# Altium project PCB_Electronic_Lab_v0.PrjPcb
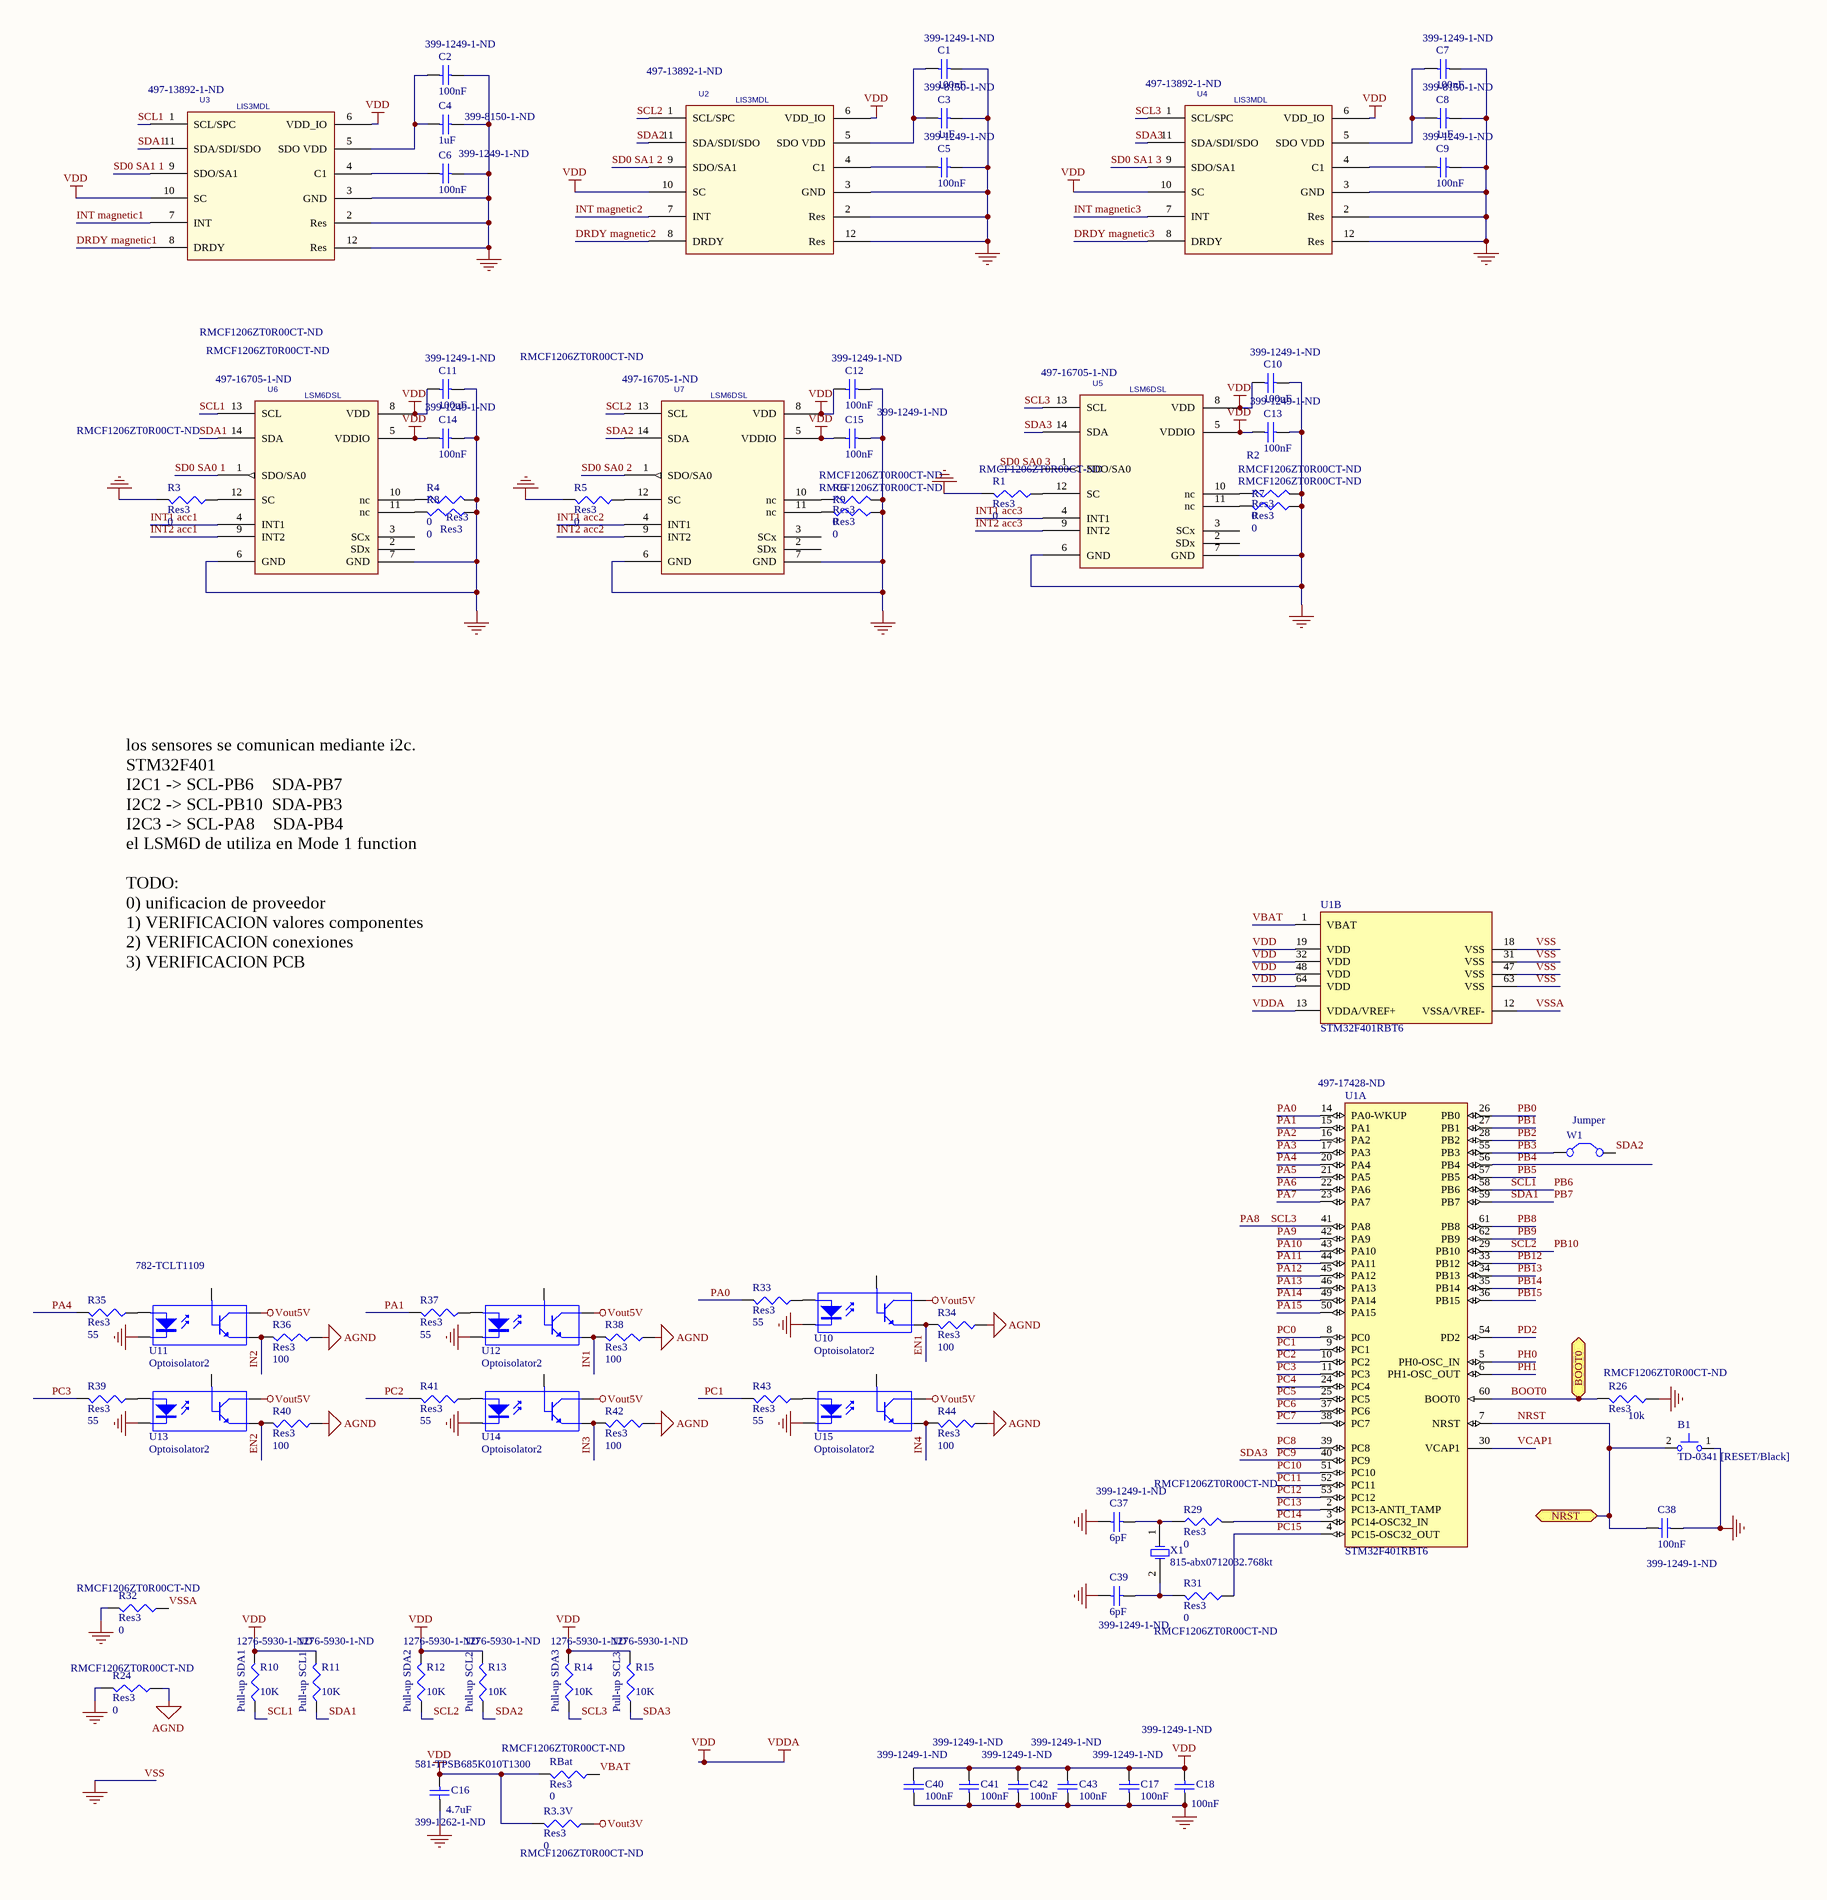
[diagram p0: PCB1.SchDoc, left]
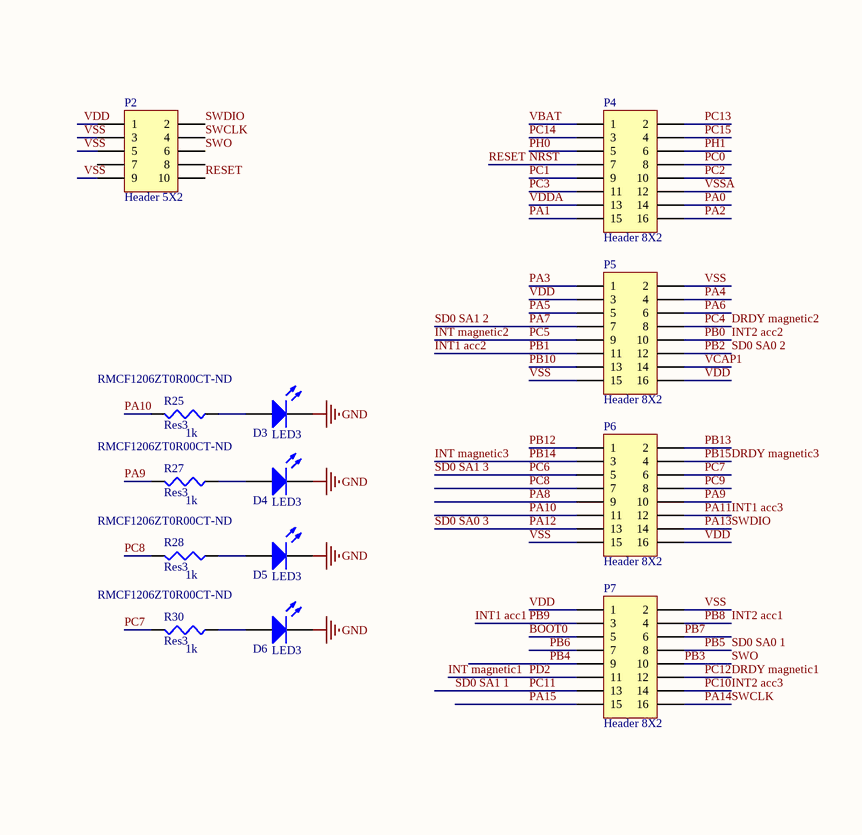
[diagram p1: PCB1.SchDoc, right]
2 sheets, 123 parts. Net scope: global (net labels, ports and power ports of the same name join across sheets).
Board file: PCB2.PcbDoc
Sheets:
  PCB1.SchDoc
  Driver&Converter.SchDoc

## Sheet PCB1.SchDoc
size A2

### Parts
B1  TD-0341 [RESET/Black]  [KSS-2G]
C1  value 100nF  Supplier Part Number 1: 399-1249-1-ND  [C1206]  (hidden comment: Cap Semi)
C2  value 100nF  Supplier Part Number 1: 399-1249-1-ND  [C1206]  (hidden comment: Cap Semi)
C3  value 1uF  Supplier Part Number 1: 399-8150-1-ND  [C1206]  (hidden comment: Cap Semi)
C4  value 1uF  Supplier Part Number 1: 399-8150-1-ND  [C1206]  (hidden comment: Cap Semi)
C5  value 100nF  Supplier Part Number 1: 399-1249-1-ND  [C1206]  (hidden comment: Cap Semi)
C6  value 100nF  Supplier Part Number 1: 399-1249-1-ND  [C1206]  (hidden comment: Cap Semi)
C7  value 100nF  Supplier Part Number 1: 399-1249-1-ND  [C1206]  (hidden comment: Cap Semi)
C8  value 1uF  Supplier Part Number 1: 399-8150-1-ND  [C1206]  (hidden comment: Cap Semi)
C9  value 100nF  Supplier Part Number 1: 399-1249-1-ND  [C1206]  (hidden comment: Cap Semi)
C10  value 100nF  Supplier Part Number 1: 399-1249-1-ND  [C1206]  (hidden comment: Cap Semi)
C11  value 100nF  Supplier Part Number 1: 399-1249-1-ND  [C1206]  (hidden comment: Cap Semi)
C12  value 100nF  Supplier Part Number 1: 399-1249-1-ND  [C1206]  (hidden comment: Cap Semi)
C13  value 100nF  Supplier Part Number 1: 399-1249-1-ND  [C1206]  (hidden comment: Cap Semi)
C14  value 100nF  Supplier Part Number 1: 399-1249-1-ND  [C1206]  (hidden comment: Cap Semi)
C15  value 100nF  Supplier Part Number 1: 399-1249-1-ND  [C1206]  (hidden comment: Cap Semi)
C16  value 4.7uF  Supplier Part Number 1: 399-1262-1-ND  Supplier Part Number 2: 581-TPSB685K010T1300  [C1206]  (hidden comment: Cap Semi)
C17  value 100nF  Supplier Part Number 1: 399-1249-1-ND  [C1206]  (hidden comment: Cap Semi)
C18  value 100nF  Supplier Part Number 1: 399-1249-1-ND  [C1206]  (hidden comment: Cap Semi)
C37  value 6pF  Supplier Part Number 1: 399-1249-1-ND  [C1206]  (hidden comment: Cap Semi)
C38  value 100nF  Supplier Part Number 1: 399-1249-1-ND  [C1206]  (hidden comment: Cap Semi)
C39  value 6pF  Supplier Part Number 1: 399-1249-1-ND  [C1206]  (hidden comment: Cap Semi)
C40  value 100nF  Supplier Part Number 1: 399-1249-1-ND  [C1206]  (hidden comment: Cap Semi)
C41  value 100nF  Supplier Part Number 1: 399-1249-1-ND  [C1206]  (hidden comment: Cap Semi)
C42  value 100nF  Supplier Part Number 1: 399-1249-1-ND  [C1206]  (hidden comment: Cap Semi)
C43  value 100nF  Supplier Part Number 1: 399-1249-1-ND  [C1206]  (hidden comment: Cap Semi)
D3  LED3  [3.5X2.8X1.9]
D4  LED3  [3.5X2.8X1.9]
D5  LED3  [3.5X2.8X1.9]
D6  LED3  [3.5X2.8X1.9]
P2  Header 5X2  [HDR2X5]
P4  Header 8X2  [HDR2X8]
P5  Header 8X2  [HDR2X8]
P6  Header 8X2  [HDR2X8]
P7  Header 8X2  [HDR2X8]
R1  Res3  value 0  Supplier Part Number 1: RMCF1206ZT0R00CT-ND  [J1-0603]
R2  Res3  value 0  Supplier Part Number 1: RMCF1206ZT0R00CT-ND  [J1-0603]
R3  Res3  value 0  Supplier Part Number 1: RMCF1206ZT0R00CT-ND  [J1-0603]
R3.3V  Res3  value 0  Supplier Part Number 1: RMCF1206ZT0R00CT-ND  [J1-0603]
R4  Res3  value 0  Supplier Part Number 1: RMCF1206ZT0R00CT-ND  [J1-0603]
R5  Res3  value 0  Supplier Part Number 1: RMCF1206ZT0R00CT-ND  [J1-0603]
R6  Res3  value 0  Supplier Part Number 1: RMCF1206ZT0R00CT-ND  [J1-0603]
R7  Res3  value 0  Supplier Part Number 1: RMCF1206ZT0R00CT-ND  [J1-0603]
R8  Res3  value 0  Supplier Part Number 1: RMCF1206ZT0R00CT-ND  [J1-0603]
R9  Res3  value 0  Supplier Part Number 1: RMCF1206ZT0R00CT-ND  [J1-0603]
R10  Pull-up SDA1  value 10K  Supplier Part Number 1: 1276-5930-1-ND  [J1-0603]
R11  Pull-up SCL1  value 10K  Supplier Part Number 1: 1276-5930-1-ND  [J1-0603]
R12  Pull-up SDA2  value 10K  Supplier Part Number 1: 1276-5930-1-ND  [J1-0603]
R13  Pull-up SCL2  value 10K  Supplier Part Number 1: 1276-5930-1-ND  [J1-0603]
R14  Pull-up SDA3  value 10K  Supplier Part Number 1: 1276-5930-1-ND  [J1-0603]
R15  Pull-up SCL3  value 10K  Supplier Part Number 1: 1276-5930-1-ND  [J1-0603]
R24  Res3  value 0  Supplier Part Number 1: RMCF1206ZT0R00CT-ND  [J1-0603]
R25  Res3  value 1k  Supplier Part Number 1: RMCF1206ZT0R00CT-ND  [J1-0603]
R26  Res3  value 10k  Supplier Part Number 1: RMCF1206ZT0R00CT-ND  [J1-0603]
R27  Res3  value 1k  Supplier Part Number 1: RMCF1206ZT0R00CT-ND  [J1-0603]
R28  Res3  value 1k  Supplier Part Number 1: RMCF1206ZT0R00CT-ND  [J1-0603]
R29  Res3  value 0  Supplier Part Number 1: RMCF1206ZT0R00CT-ND  [J1-0603]
R30  Res3  value 1k  Supplier Part Number 1: RMCF1206ZT0R00CT-ND  [J1-0603]
R31  Res3  value 0  Supplier Part Number 1: RMCF1206ZT0R00CT-ND  [J1-0603]
R32  Res3  value 0  Supplier Part Number 1: RMCF1206ZT0R00CT-ND  [J1-0603]
R33  Res3  value 55  [J1-0603]
R34  Res3  value 100  [J1-0603]
R35  Res3  value 55  [J1-0603]
R36  Res3  value 100  [J1-0603]
R37  Res3  value 55  [J1-0603]
R38  Res3  value 100  [J1-0603]
R39  Res3  value 55  [J1-0603]
R40  Res3  value 100  [J1-0603]
R41  Res3  value 55  [J1-0603]
R42  Res3  value 100  [J1-0603]
R43  Res3  value 55  [J1-0603]
R44  Res3  value 100  [J1-0603]
RBat  Res3  value 0  Supplier Part Number 1: RMCF1206ZT0R00CT-ND  [J1-0603]
U1  STM32F401RBT6  Supplier Part Number 3: 497-17428-ND  [STM-LQFP64_N]  (parts A,B of 2)
U2  LIS3MDL  Supplier Part Number 1: 497-13892-1-ND  [LGA12 2x2x1mm]
U3  LIS3MDL  Supplier Part Number 1: 497-13892-1-ND  [LGA12 2x2x1mm]
U4  LIS3MDL  Supplier Part Number 1: 497-13892-1-ND  [LGA12 2x2x1mm]
U5  LSM6DSL  Supplier Part Number 1: 497-16705-1-ND  [LGA14L-2.5X3X0.86p0.5]
U6  LSM6DSL  Supplier Part Number 1: 497-16705-1-ND  [LGA14L-2.5X3X0.86p0.5]
U7  LSM6DSL  Supplier Part Number 1: 497-16705-1-ND  [LGA14L-2.5X3X0.86p0.5]
U10  Optoisolator2  [SOP5(6)]
U11  Optoisolator2  Supplier Part Number 1: 782-TCLT1109  [SOP5(6)]
U12  Optoisolator2  [SOP5(6)]
U13  Optoisolator2  [SOP5(6)]
U14  Optoisolator2  [SOP5(6)]
U15  Optoisolator2  [SOP5(6)]
W1  Jumper  [HDR1X2]
X1  815-abx0712032.768kt  [CAPC3216M]

### Ports
BOOT0, NRST

### Nets
AGND: R24.1 R34.1 R36.1 R38.1 R40.1 R42.1 R44.1
VDD: C10.2 C11.2 C12.2 C13.2 C14.2 C15.2 C16.2 C17.2 C18.2 C40.2 C41.2 C42.2 C43.2 P2.1 P4.13 P5.3 P5.16 P6.16 P7.1 R3.3V.2 R10.2 R11.2 R12.2 R13.2 R14.2 R15.2 RBat.2 U1.13(VDDA/VREF+) U1.19(VDD) U1.32(VDD) U1.48(VDD) U1.64(VDD) U2.6(VDD_IO) U2.10(SC) U3.6(VDD_IO) U3.10(SC) U4.6(VDD_IO) U4.10(SC) U5.5(VDDIO) U5.8(VDD) U6.5(VDDIO) U6.8(VDD) U7.5(VDDIO) U7.8(VDD)  [also labelled VDDA]
Vout3V: R3.3V.1
Vout5V: U10.5(C) U11.5(C) U12.5(C) U13.5(C) U14.5(C) U15.5(C)
VSS: B1.1 C1.1 C2.1 C3.1 C4.1 C5.1 C6.1 C7.1 C8.1 C9.1 C10.1 C11.1 C12.1 C13.1 C14.1 C15.1 C16.1 C17.1 C18.1 C37.2 C38.1 C39.2 C40.1 C41.1 C42.1 C43.1 D3.2(K) D4.2(K) D5.2(K) D6.2(K) P2.3 P2.5 P2.9 P5.2 P5.15 P6.15 P7.2 R1.2 R2.2 R3.2 R4.2 R5.2 R6.2 R7.1 R8.1 R9.1 R24.2 R26.1 R32.2 U1.18(VSS) U1.31(VSS) U1.47(VSS) U1.63(VSS) U2.2(Res) U2.3(GND) U2.12(Res) U3.2(Res) U3.3(GND) U3.12(Res) U4.2(Res) U4.3(GND) U4.12(Res) U5.6(GND) U5.7(GND) U6.6(GND) U6.7(GND) U7.6(GND) U7.7(GND) U10.3(K) U11.3(K) U12.3(K) U13.3(K) U14.3(K) U15.3(K)  [also labelled GND]
BOOT0: P7.5 R26.2 U1.60(BOOT0) ; port BOOT0
DRDY magnetic1: P7.12 U1.53(PC12) U3.8(DRDY)  [also labelled PC12]
DRDY magnetic2: P5.8 U1.24(PC4) U2.8(DRDY)  [also labelled PC4]
DRDY magnetic3: P6.4 U1.36(PB15) U4.8(DRDY)  [also labelled PB15]
EN1: R34.2 U10.4(E)
EN2: R40.2 U13.4(E)
IN1: R38.2 U12.4(E)
IN2: R36.2 U11.4(E)
IN3: R42.2 U14.4(E)
IN4: R44.2 U15.4(E)
INT1 acc1: P7.3 U1.62(PB9) U6.4(INT1)  [also labelled PB9]
INT1 acc2: P5.11 U1.27(PB1) U7.4(INT1)  [also labelled PB1]
INT1 acc3: P6.12 U1.44(PA11) U5.4(INT1)  [also labelled PA11]
INT2 acc1: P7.4 U1.61(PB8) U6.9(INT2)  [also labelled PB8]
INT2 acc2: P5.10 U1.26(PB0) U7.9(INT2)  [also labelled PB0]
INT2 acc3: P7.14 U1.51(PC10) U5.9(INT2)  [also labelled PC10]
INT magnetic1: P7.11 U1.54(PD2) U3.7(INT)  [also labelled PD2]
INT magnetic2: P5.9 U1.25(PC5) U2.7(INT)  [also labelled PC5]
INT magnetic3: P6.3 U1.35(PB14) U4.7(INT)  [also labelled PB14]
NRST: B1.2 C38.2 P2.10 P4.7 U1.7(NRST) ; port NRST  [also labelled RESET]
PA0: P4.14 R33.2 U1.14(PA0-WKUP)
PA1: P4.15 R37.2 U1.15(PA1)
PA2: P4.16 U1.16(PA2)
PA3: P5.1 U1.17(PA3)
PA4: P5.4 R35.2 U1.20(PA4)
PA5: P5.5 U1.21(PA5)
PA6: P5.6 U1.22(PA6)
PA7: P5.7 U1.23(PA7) U2.9(SDO/SA1)  [also labelled SD0 SA1 2]
PA8: P6.9 R14.1 U1.41(PA8) U4.1(SCL/SPC) U5.13(SCL)  [also labelled SCL3]
PA9: P6.10 R27.2 U1.42(PA9)
PA10: P6.11 R25.2 U1.43(PA10)
PA12: P6.13 U1.45(PA12) U5.1(SDO/SA0)  [also labelled SD0 SA0 3]
PA13: P2.2 P6.14 U1.46(PA13)  [also labelled SWDIO]
PA14: P2.4 P7.16 U1.49(PA14)  [also labelled SWCLK]
PA15: P7.15 U1.50(PA15)
PB2: P5.12 U1.28(PB2) U7.1(SDO/SA0)  [also labelled SD0 SA0 2]
PB3: P2.6 P7.10 U1.55(PB3) W1.1(C1)  [also labelled SWO]
PB4: P7.9 U1.56(PB4)
PB5: P7.8 U1.57(PB5) U6.1(SDO/SA0)  [also labelled SD0 SA0 1]
PB6: P7.7 R10.1 U1.58(PB6) U3.1(SCL/SPC) U6.13(SCL)  [also labelled SCL1]
PB7: P7.6 R11.1 U1.59(PB7) U3.11(SDA/SDI/SDO) U6.14(SDA)  [also labelled SDA1]
PB10: P5.13 R12.1 U1.29(PB10) U2.1(SCL/SPC) U7.13(SCL)  [also labelled SCL2]
PB12: P6.1 U1.33(PB12)
PB13: P6.2 U1.34(PB13)
PC0: P4.8 U1.8(PC0)
PC1: P4.9 R43.2 U1.9(PC1)
PC2: P4.10 R41.2 U1.10(PC2)
PC3: P4.11 R39.2 U1.11(PC3)
PC6: P6.5 U1.37(PC6) U4.9(SDO/SA1)  [also labelled SD0 SA1 3]
PC7: P6.6 R30.2 U1.38(PC7)
PC8: P6.7 R28.2 U1.39(PC8)
PC9: P6.8 R15.1 U1.40(PC9) U4.11(SDA/SDI/SDO) U5.14(SDA)  [also labelled SDA3]
PC11: P7.13 U1.52(PC11) U3.9(SDO/SA1)  [also labelled SD0 SA1 1]
PC13: P4.2 U1.2(PC13-ANTI_TAMP)
PC14: P4.3 R29.2 U1.3(PC14-OSC32_IN)
PC15: P4.4 R31.1 U1.4(PC15-OSC32_OUT)
PH0: P4.5 U1.5(PH0-OSC_IN)
PH1: P4.6 U1.6(PH1-OSC_OUT)
SDA2: R13.1 U2.11(SDA/SDI/SDO) U7.14(SDA) W1.2(C2)
VBAT: P4.1 RBat.1 U1.1(VBAT)
VCAP1: P5.14 U1.30(VCAP1)
VSSA: P4.12 R32.1 U1.12(VSSA/VREF-)
NetC1_2: C1.2 C3.2 U2.5(SDO_VDD)
NetC2_2: C2.2 C4.2 U3.5(SDO_VDD)
NetC5_2: C5.2 U2.4(C1)
NetC6_2: C6.2 U3.4(C1)
NetC7_2: C7.2 C8.2 U4.5(SDO_VDD)
NetC9_2: C9.2 U4.4(C1)
NetC37_1: C37.1 R29.1 X1.1(OSC1)
NetC39_1: C39.1 R31.2 X1.2(OSC2)
NetD3_1: D3.1(A) R25.1
NetD4_1: D4.1(A) R27.1
NetD5_1: D5.1(A) R28.1
NetD6_1: D6.1(A) R30.1
NetR1_1: R1.1 U5.12(SC)
NetR2_1: R2.1 U5.10(nc)
NetR3_1: R3.1 U6.12(SC)
NetR4_1: R4.1 U6.10(nc)
NetR5_1: R5.1 U7.12(SC)
NetR6_1: R6.1 U7.10(nc)
NetR7_2: R7.2 U5.11(nc)
NetR8_2: R8.2 U6.11(nc)
NetR9_2: R9.2 U7.11(nc)
NetR33_1: R33.1 U10.1(A)
NetR35_1: R35.1 U11.1(A)
NetR37_1: R37.1 U12.1(A)
NetR39_1: R39.1 U13.1(A)
NetR41_1: R41.1 U14.1(A)
NetR43_1: R43.1 U15.1(A)

Not connected (* = marked no-connect by the designer): P2 7 8; U5 2(SDx) 3(SCx); U6 2(SDx) 3(SCx); U7 2(SDx) 3(SCx); U10 6(B); U11 6(B); U12 6(B); U13 6(B); U14 6(B); U15 6(B)

### Notes on the sheet
- los sensores se comunican mediante i2c.
  STM32F401
  I2C1 -> SCL-PB6    SDA-PB7
  I2C2 -> SCL-PB10  SDA-PB3
  I2C3 -> SCL-PA8    SDA-PB4
  el LSM6D de utiliza en Mode 1 function
  TODO:
  0) unificacion de proveedor
  1) VERIFICACION valores componentes
  2) VERIFICACION conexiones
  3) VERIFICACION PCB

### Library data of the parts
B1 = KSS241GLFS: Switch, Subminiature Side-Actuated Tact, SMT, KSS Series, Std Actuator, 2 Gull Wing Leads, SPST, 4N Force, Silver Contact; PCB_Layout: Complies with manufacturer's recommendation.; Published: 14-Mar-2008; DatasheetVersion: Aug-2007; PackageVersion: Aug-2007; PackageReference: KSS-2G; Publisher: Altium Limited; PackageDescription: Subminiature SMT Side Actuated Switch, Body 7 x 3.5 mm (LxW); ComponentLink1Description: Manufacturer Link; ComponentLink1URL: http://www.ck-components.com/; ComponentLink2Description: Datasheet; ComponentLink2URL: http://www.ck-components.com/media/pdf/catalogs/Tactile_Switches%5CKSS_series_Tactile_August_2007.pdf
C1-C18 C37-C43 = Cap Semi: Capacitor (Semiconductor SIM Model); Published: 8-Jun-2000; LatestRevisionDate: 29-May-2009; LatestRevisionNote: IPC-7351 Footprint Added.; PackageReference: C1206; Publisher: Altium Limited; PackageDescription: Chip Capacitor; Supplier 1: Digi-Key
  C16: Supplier 2: Mouser
D3-D6 = LED3: Typical BLUE SiC LED; Published: 8-Jun-2000; LatestRevisionDate: 17-Dec-2003; LatestRevisionNote: PCB Footprint replaced.; DatasheetVersion: 16-Apr-2002; PackageVersion: 16-Apr-2002; PackageReference: 3.5X2.8X1.9; Publisher: Altium Limited; PackageDescription: SM LED; 2 C-Bend Leads; Body 3.5 x 2.8 x 1.9 mm, inc leads (LxWxH typ)
P2 = Header 5X2: Header, 5-Pin, Dual row; LatestRevisionDate: 17-Jul-2002; LatestRevisionNote: Re-released for DXP Platform.; Publisher: Altium Limited
P4-P7 = Header 8X2: Header, 8-Pin, Dual row; LatestRevisionDate: 17-Jul-2002; LatestRevisionNote: Re-released for DXP Platform.; Publisher: Altium Limited
R1-R3 R3.3V R4-R15 R24-R44 RBat = Res3: Resistor; Published: 8-Jun-2000; LatestRevisionDate: 29-May-2009; LatestRevisionNote: IPC-7351 Footprint Added.; PackageReference: J1-0603; Publisher: Altium Limited; PackageDescription: Chip Resistor
  R1-R3 R3.3V R4-R15 R24-R32 RBat: Supplier 1: Digi-Key
U1 = STM32F401RBT6: ARM Cortex-M4 32-bit MCU+FPU, 105 DMIPS, 128 kB Flash, 64 kB Internal RAM, 48 I/Os, 64-pin LQFP, -40 to 85 degC, Tray; Manufacturer: STMicroelectronics; FLASH Size (Prog) (kB): 128; I/Os (High Current): 48; Internal RAM Size (kB): 64; Operating Frequency(F) (Processor speed) (MHz): 84; Supply Voltage(Vcc) max (V): 3.6; Supply Voltage(Vcc) min (V): 1.8; DatasheetVersion: Rev. 1; PackageVersion: Rev. 4, 06/2013; PackageReference: LQFP64; PackageDescription: 64-Pin Low Profile Quad Flat Package, 10 x 10 mm Body, 0.5 mm Pitch; Supplier 1: Newark; Supplier Part Number 1: 19X6220; Supplier 2: Mouser; Supplier Part Number 2: 511-STM32F401RBT6; Core: ARM Cortex-M4; Packing: Tray; Mounting Technology: Surface Mount; PartNumber: STM32F401RBT6; ComponentLink1Description: Manufacturer URL; ComponentLink1URL: http://www.st.com/web/en/home.html; ComponentLink2Description: Datasheet; ComponentLink2URL: http://www.st.com/st-web-ui/static/active/en/resource/technical/document/data_brief/DM00071938.pdf; ComponentLink3Description: Package Specification; ComponentLink3URL: http://www.st.com/st-web-ui/static/active/en/resource/technical/document/datasheet/DM00037051.pdf; Supplier 3: Digi-Key
U2-U4 = LIS3MDL: Magnetic sensor MEMS (3 Axis); Supplier Part Number: LIS3MDL; Value: LIS3MDL; RoHS: RoHS Compliant; Supplier Device Package: LGA12; Supplier 1: Digi-Key
U5-U7 = LSM6DSL: Accelero + Gyro MEMS (6 Axis); Supplier Part Number: LSM6DSL; Value: LSM6DSL; RoHS: RoHS Compliant; Supplier Device Package: LGA14; Supplier 1: Digi-Key
U10-U15 = Optoisolator2: 5 Pin Mini Flat Pack Optocoupler; Model: TCLT1109; Published: 24-Mar-1999; LatestRevisionDate: 04-Mar-2005; LatestRevisionNote: PCB Footprint replaced, Sch pins re-numbered.; DatasheetVersion: Apr-2004; PackageReference: SOP5(6); Publisher: Altium Limited; PackageDescription: Small Outline; 6 Leads (1 Absent); Body Width 4.4 mm; Pitch 1.27 mm
  U11: Supplier 1: Mouser
W1 = Jumper: Jumper Wire; Published: 24-Mar-1999; LatestRevisionDate: 17-Jul-2002; LatestRevisionNote: Re-released for DXP Platform.; PackageReference: RAD-0.2; Publisher: Altium Limited; PackageDescription: Radial Cap, Thru-Hole; 2 Leads; 0.2 in Pin Spacing
X1 = XTAL: Crystal Oscillator; Published: 8-Jun-2000; LatestRevisionDate: 17-Jul-2002; LatestRevisionNote: Re-released for DXP Platform.; PackageReference: R38; Publisher: Altium Limited; PackageDescription: Crystal, Thru-Hole; 2 Leads; Body 3.1 x 8.2 mm (Dia.xH)

## Sheet Driver&Converter.SchDoc
size A4
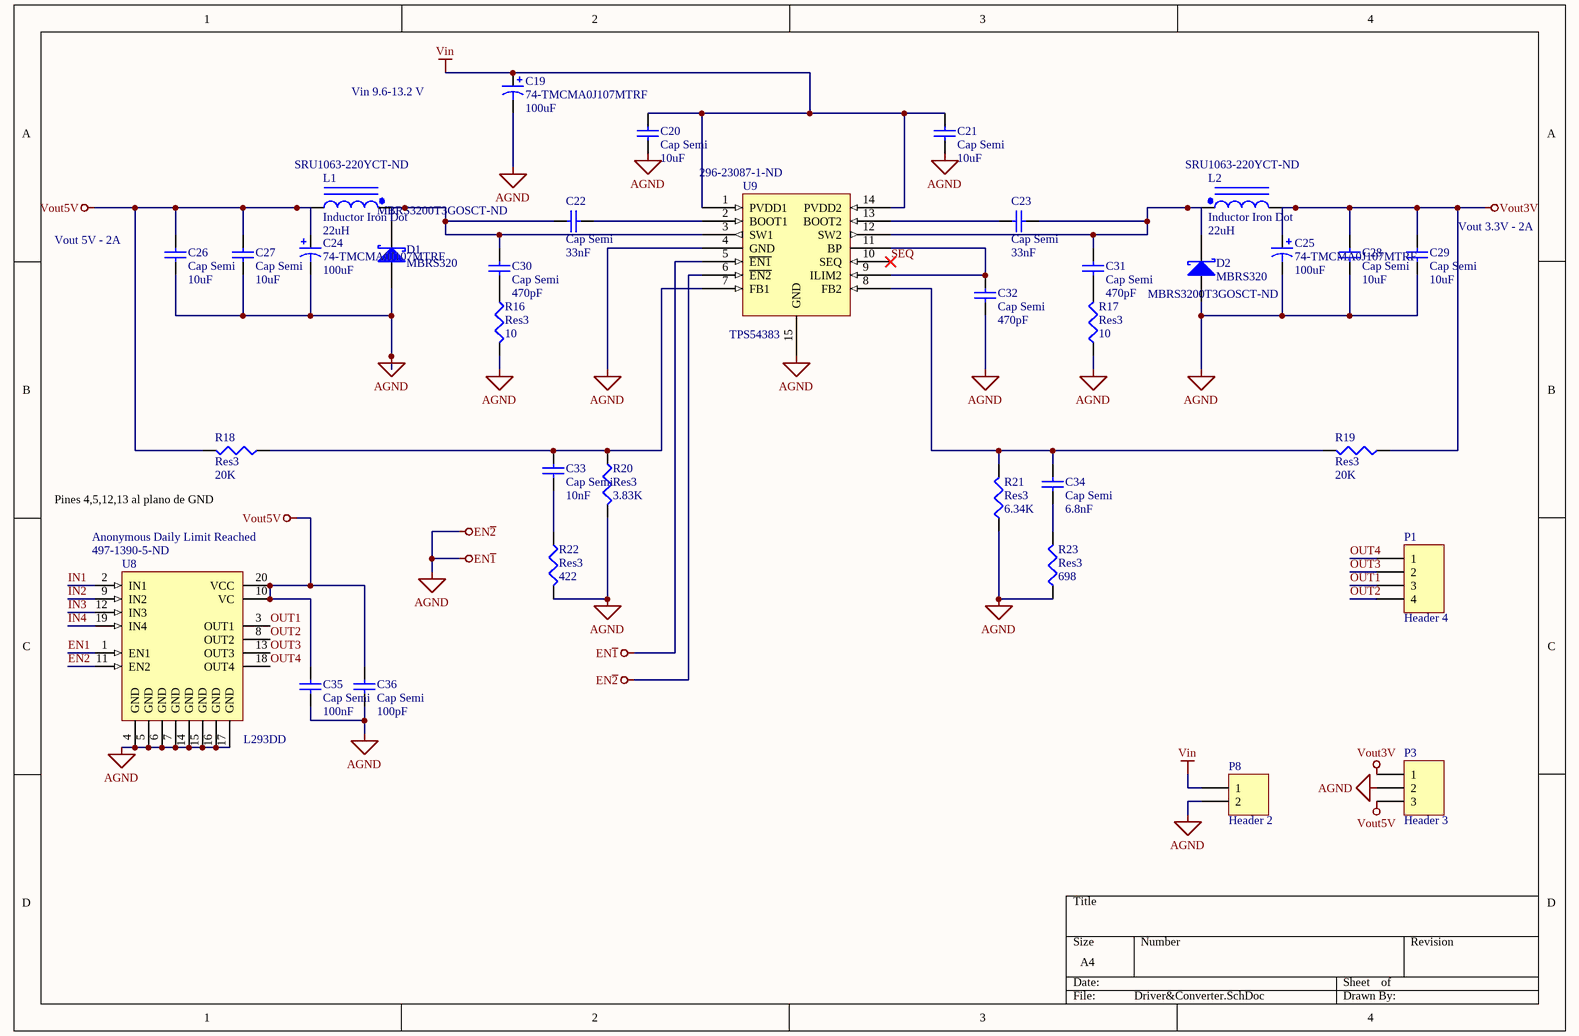
[diagram p2: Driver&Converter.SchDoc]

### Parts
C19  74-TMCMA0J107MTRF  value 100uF  [C1206]
C20  Cap Semi  value 10uF  [C1206]
C21  Cap Semi  value 10uF  [C1206]
C22  Cap Semi  value 33nF  [C1206]
C23  Cap Semi  value 33nF  [C1206]
C24  74-TMCMA0J107MTRF  value 100uF  [C1206]
C25  74-TMCMA0J107MTRF  value 100uF  [C1206]
C26  Cap Semi  value 10uF  [C1206]
C27  Cap Semi  value 10uF  [C1206]
C28  Cap Semi  value 10uF  [C1206]
C29  Cap Semi  value 10uF  [C1206]
C30  Cap Semi  value 470pF  [C1206]
C31  Cap Semi  value 470pF  [C1206]
C32  Cap Semi  value 470pF  [C1206]
C33  Cap Semi  value 10nF  [C1206]
C34  Cap Semi  value 6.8nF  [C1206]
C35  Cap Semi  value 100nF  [C1206]
C36  Cap Semi  value 100pF  [C1206]
D1  MBRS320  Supplier Part Number 1: MBRS3200T3GOSCT-ND  [SMB]
D2  MBRS320  Supplier Part Number 1: MBRS3200T3GOSCT-ND  [SMB]
L1  Inductor Iron Dot  value 22uH  Supplier Part Number 1: SRU1063-220YCT-ND  [DIODE_SMC]
L2  Inductor Iron Dot  value 22uH  Supplier Part Number 1: SRU1063-220YCT-ND  [DIODE_SMC]
P1  Header 4  [HDR1X4]
P3  Header 3  [HDR1X3]
P8  Header 2  [HDR1X2]
R16  Res3  value 10  [J1-0603]
R17  Res3  value 10  [J1-0603]
R18  Res3  value 20K  [J1-0603]
R19  Res3  value 20K  [J1-0603]
R20  Res3  value 3.83K  [J1-0603]
R21  Res3  value 6.34K  [J1-0603]
R22  Res3  value 422  [J1-0603]
R23  Res3  value 698  [J1-0603]
U8  L293DD  Supplier Part Number 1: 497-1390-5-ND  Supplier Part Number 2: Anonymous Daily Limit Reached  [SO20_N]
U9  TPS54383  Supplier Part Number 1: 296-23087-1-ND  [TPS54383_converter]

### Nets
AGND: C19.2 C20.1 C21.1 C24.2 C25.2 C26.1 C27.1 C28.1 C29.1 C32.1 C35.1 C36.1 D1.1(A) D2.1(A) P3.2 P8.2 R16.1 R17.1 R20.1 R21.1 R22.1 R23.1 U8.4(GND) U8.5(GND) U8.6(GND) U8.7(GND) U8.14(GND) U8.15(GND) U8.16(GND) U8.17(GND) U9.4(GND) U9.5(~{EN1}) U9.6(~{EN2}) U9.15(GND)  [also labelled EN~{1}, EN~{2}]
Vin: C19.1 C20.2 C21.2 P8.1 U9.1(PVDD1) U9.14(PVDD2)
Vout3V: C25.1 C28.2 C29.2 L2.2 P3.1 R19.1
Vout5V: C24.1 C26.2 C27.2 C35.2 C36.2 L1.2 P3.3 R18.1 U8.10(VC) U8.20(VCC)
EN1: U8.1(EN1)
EN2: U8.11(EN2)
IN1: U8.2(IN1)
IN2: U8.9(IN2)
IN3: U8.12(IN3)
IN4: U8.19(IN4)
OUT1: P1.3 U8.3(OUT1)
OUT2: P1.4 U8.8(OUT2)
OUT3: P1.2 U8.13(OUT3)
OUT4: P1.1 U8.18(OUT4)
SEQ: U9.10(SEQ)
NetC22_1: C22.1 C30.2 D1.2(K) L1.1 U9.3(SW1)
NetC22_2: C22.2 U9.2(BOOT1)
NetC23_1: C23.1 C31.2 D2.2(K) L2.1 U9.12(SW2)
NetC23_2: C23.2 U9.13(BOOT2)
NetC30_1: C30.1 R16.2
NetC31_1: C31.1 R17.2
NetC32_2: C32.2 U9.9(ILIM2) U9.11(BP)
NetC33_1: C33.1 R22.2
NetC33_2: C33.2 R18.2 R20.2 U9.7(FB1)
NetC34_1: C34.1 R23.2
NetC34_2: C34.2 R19.2 R21.2 U9.8(FB2)

### Notes on the sheet
- Vin 9.6-13.2 V
- (near C26) Vout 5V - 2A
- (near C29) Vout 3.3V - 2A
- (near R18) Pines 4,5,12,13 al plano de GND

### Library data of the parts
C19 C24 C25 = Cap Pol3: Polarized Capacitor (Surface Mount); Published: 8-Jun-2000; LatestRevisionDate: 29-May-2009; LatestRevisionNote: IPC-7351 Footprint Added.; PackageReference: C0805; Publisher: Altium Limited; PackageDescription: Chip Capacitor
C20-C23 C26-C36 = Cap Semi: Capacitor (Semiconductor SIM Model); Published: 8-Jun-2000; LatestRevisionDate: 29-May-2009; LatestRevisionNote: IPC-7351 Footprint Added.; PackageReference: C1206; Publisher: Altium Limited; PackageDescription: Chip Capacitor
D1 D2 = D Schottky: Schottky Diode; Published: 8-Jun-2000; LatestRevisionDate: 17-Jul-2002; LatestRevisionNote: Re-released for DXP Platform.; PackageReference: SMB; Publisher: Altium Limited; PackageDescription: DO-214-AA/SMB; 2 C-Bend Leads; Body 5.3 x 3.6 mm, inc. leads (LxW); Code_JEDEC: DO-214-AA; Supplier 1: Digi-Key
L1 L2 = Inductor Iron Dot: Magnetic-Core Inductor with Winding Polarity Marking; Published: 24-Mar-1999; LatestRevisionDate: 17-Jul-2002; LatestRevisionNote: Re-released for DXP Platform.; PackageReference: DIODE_SMC; Publisher: Altium Limited; PackageDescription: Diode; 2 Leads; Supplier 1: Digi-Key
P1 = Header 4: Header, 4-Pin; LatestRevisionDate: 17-Jul-2002; LatestRevisionNote: Re-released for DXP Platform.; Publisher: Altium Limited
P3 = Header 3: Header, 3-Pin; LatestRevisionDate: 17-Jul-2002; LatestRevisionNote: Re-released for DXP Platform.; Publisher: Altium Limited
P8 = Header 2: Header, 2-Pin; LatestRevisionDate: 17-Jul-2002; LatestRevisionNote: Re-released for DXP Platform.; Publisher: Altium Limited
R16-R23 = Res3: Resistor; Published: 8-Jun-2000; LatestRevisionDate: 29-May-2009; LatestRevisionNote: IPC-7351 Footprint Added.; PackageReference: J1-0603; Publisher: Altium Limited; PackageDescription: Chip Resistor
U8 = L293DD: Push-Pull Four Channel Driver With Diode; Published: 8-Jun-2000; LatestRevisionDate: 13-Apr-2006; LatestRevisionNote: IPC-7351 Footprint Added.; DatasheetVersion: Jun-1996; PackageVersion: Jul-2001; PackageReference: SO20; Publisher: Altium Limited; PackageDescription: 20-Pin Plastic Small Outline Integrated Circuit 1.27 mm Pitch; ComponentLink1Description: Manufacturer Link; ComponentLink1URL: http://www.st.com/; ComponentLink2Description: Datasheet; ComponentLink2URL: http://www.st.com/stonline/products/literature/ds/1330/l293d.pdf; Code_JEDEC: MS-013-AC; Code_IPC: SOIC127P1030-20; Supplier 1: Digi-Key; Supplier 2: Mouser
U9 = TPS54383: Supplier 1: Digi-Key

## Nets that join several sheets
AGND: PCB1 (7 pins), Driver&Converter (34 pins)
Vout3V: PCB1 (R3.3V.1), Driver&Converter (6 pins)
Vout5V: PCB1 (6 pins), Driver&Converter (10 pins)
EN1: PCB1 (R34.2 U10.4), Driver&Converter (U8.1)
EN2: PCB1 (R40.2 U13.4), Driver&Converter (U8.11)
IN1: PCB1 (R38.2 U12.4), Driver&Converter (U8.2)
IN2: PCB1 (R36.2 U11.4), Driver&Converter (U8.9)
IN3: PCB1 (R42.2 U14.4), Driver&Converter (U8.12)
IN4: PCB1 (R44.2 U15.4), Driver&Converter (U8.19)

## Assembly variants
Variant v0.1 of PCB_Electronic_Lab_v0: all parts fitted